# Altium project BOOSTXL-DRV8301.PrjPcb (part 2 of 2)

## Sheet SENSE.SchDoc
size 558 x 431 mm; Engineer: Nicholas Oborny; Revision: A.1; Name: Nicholas Oborny; Start Date: 7/23/2012
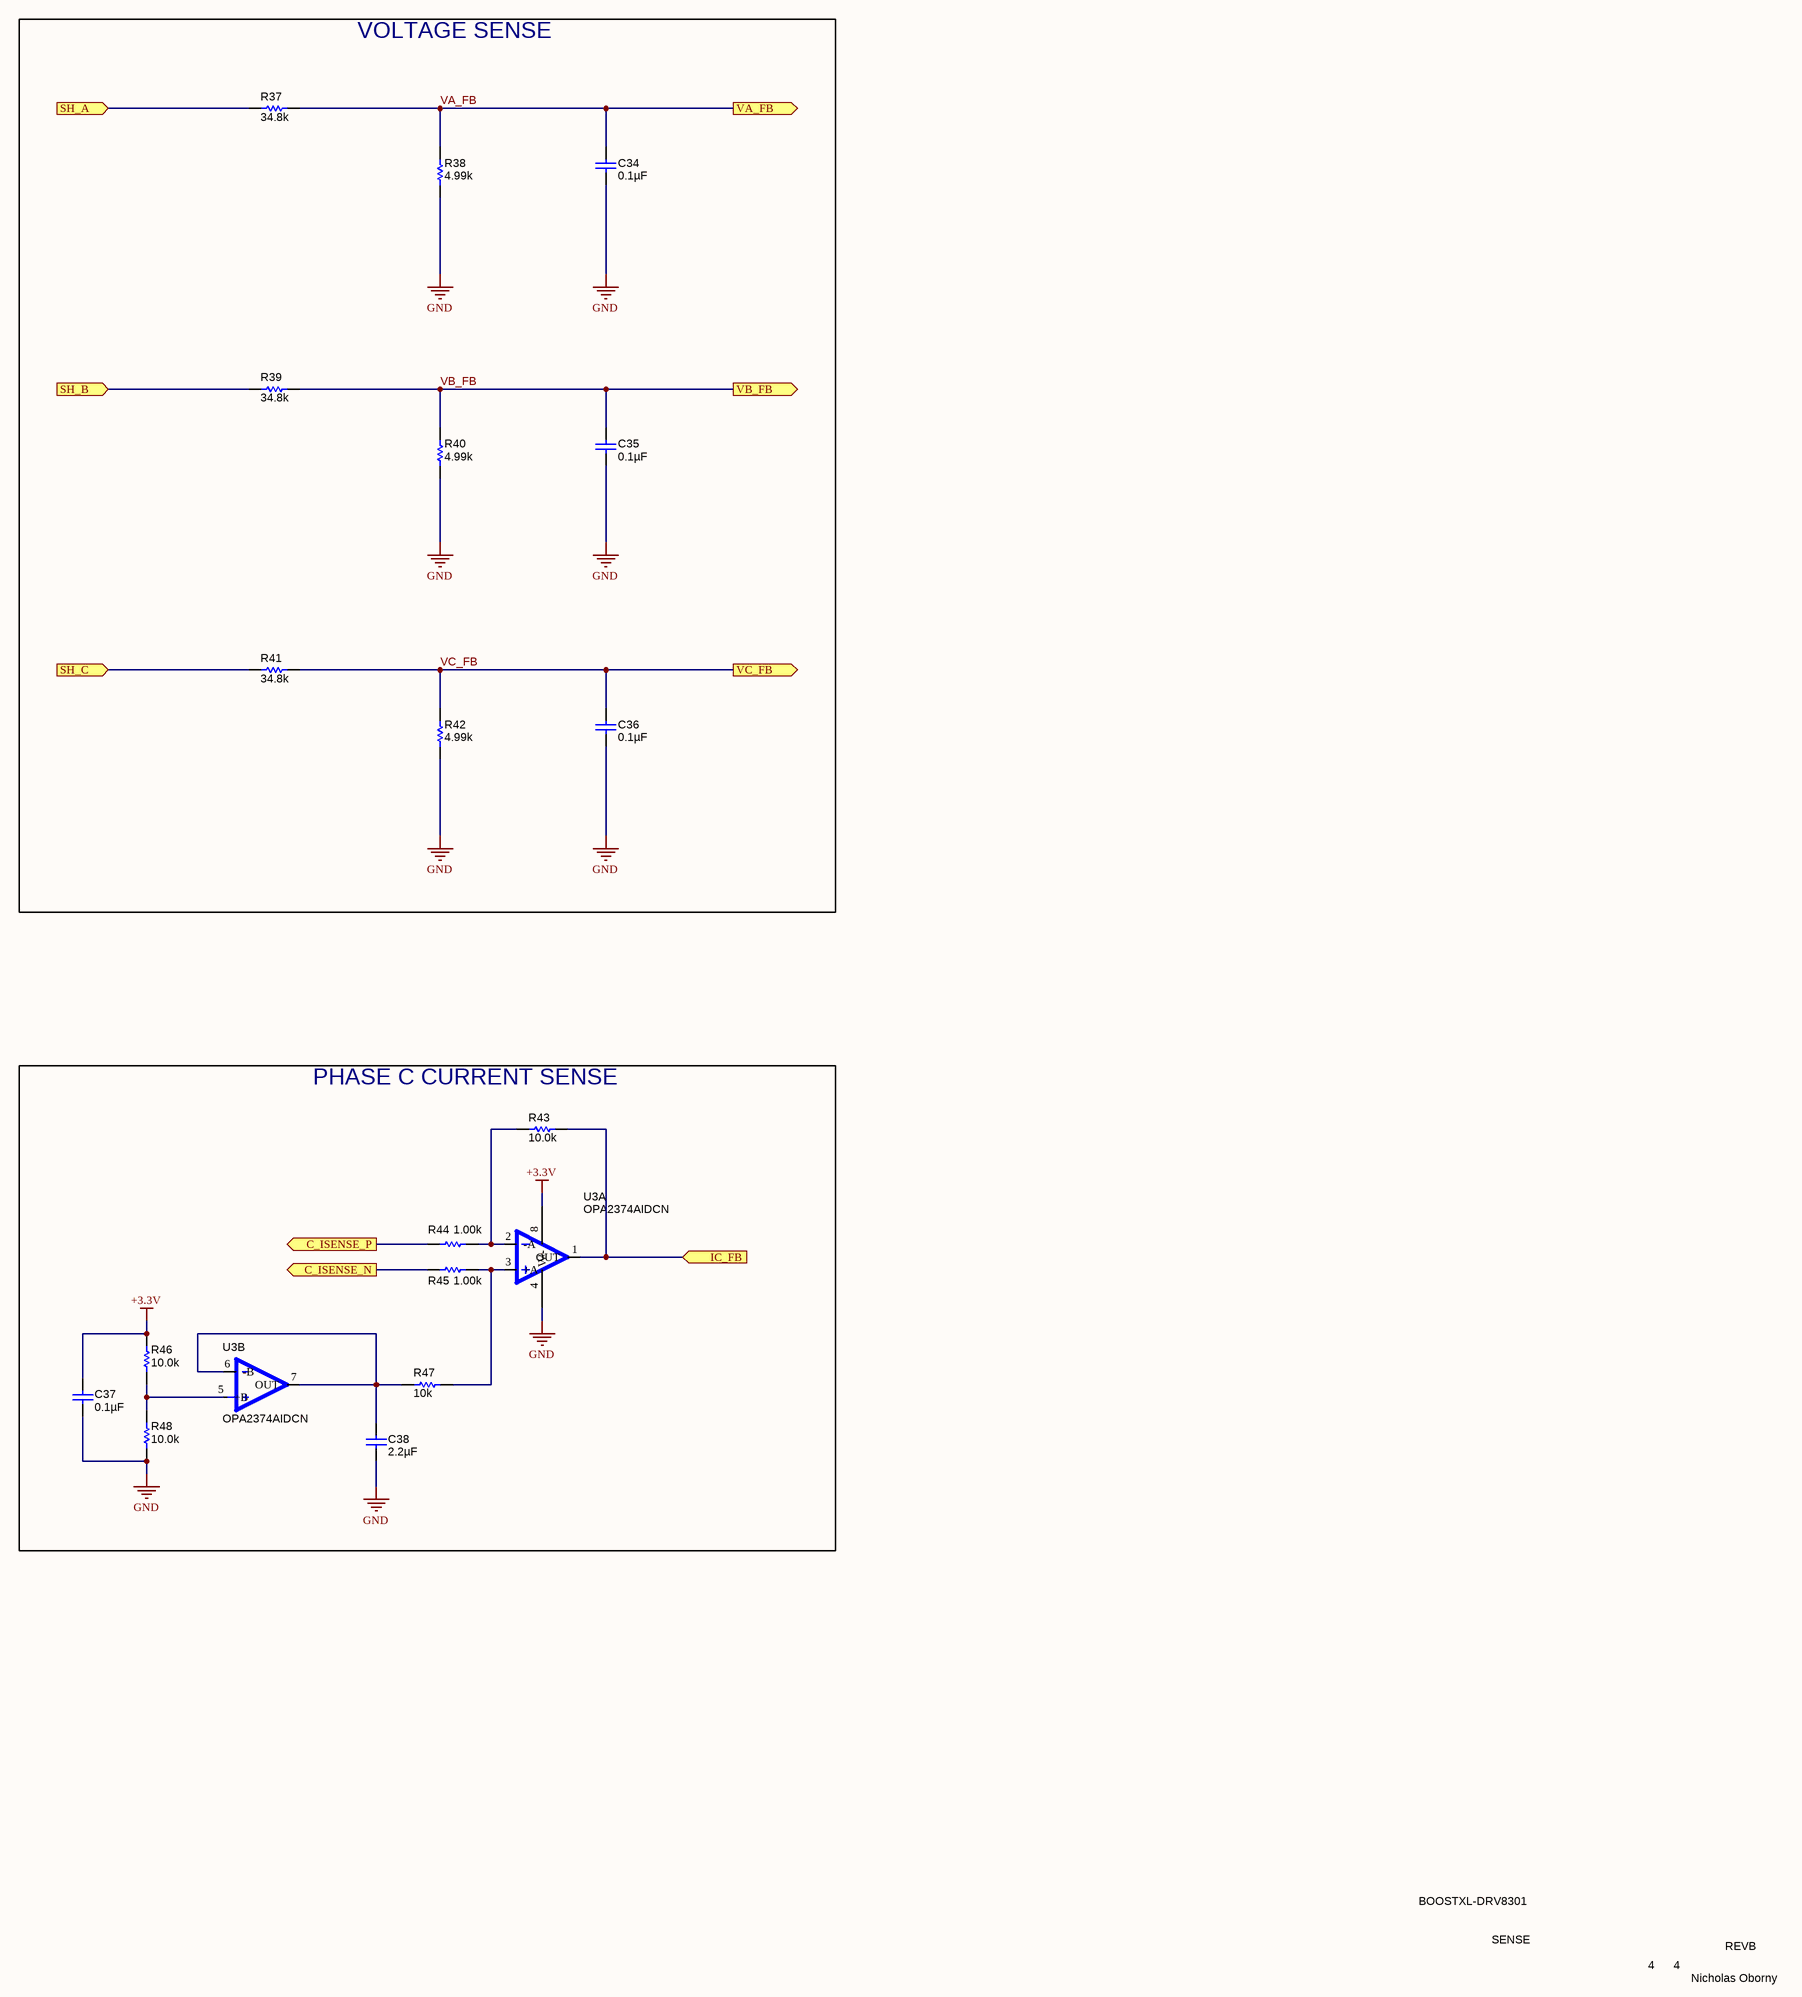
[diagram p7: SENSE.SchDoc]

### Parts
C34  ValueDisplayed: 0.1µF  [0603L]  (hidden comment: C0603C104J4RACTU)
C35  ValueDisplayed: 0.1µF  [0603L]  (hidden comment: C0603C104J4RACTU)
C36  ValueDisplayed: 0.1µF  [0603L]  (hidden comment: C0603C104J4RACTU)
C37  ValueDisplayed: 0.1µF  [0603L]  (hidden comment: C0603C104J4RACTU)
C38  ValueDisplayed: 2.2µF  [0603L]  (hidden comment: C0603C225M8PACTU)
R37  value 34.8k  [0603L]  (hidden comment: CRCW060334K8FKEA)
R38  value 4.99k  [0603L]  (hidden comment: CRCW06034K99FKEA)
R39  value 34.8k  [0603L]  (hidden comment: CRCW060334K8FKEA)
R40  value 4.99k  [0603L]  (hidden comment: CRCW06034K99FKEA)
R41  value 34.8k  [0603L]  (hidden comment: CRCW060334K8FKEA)
R42  value 4.99k  [0603L]  (hidden comment: CRCW06034K99FKEA)
R43  value 10.0k  [0603L]  (hidden comment: RG1608P-103-B-T5)
R44  value 1.00k  [0603L]  (hidden comment: CRCW06031K00FKEA)
R45  value 1.00k  [0603L]  (hidden comment: CRCW06031K00FKEA)
R46  value 10.0k  [0603L]  (hidden comment: RG1608P-103-B-T5)
R47  value 10k  [0603L]  (hidden comment: CRCW060310K0JNEA)
R48  value 10.0k  [0603L]  (hidden comment: RG1608P-103-B-T5)
U3  OPA2374AIDCN  [DCN]  (parts A,B of 2)

### Blocks framed on the sheet
VOLTAGE SENSE: C34-C36 R37-R42
PHASE C CURRENT SENSE: C37 C38 R43-R48 U3

### Ports
C_ISENSE_N, C_ISENSE_P, IC_FB, SH_A, SH_B, SH_C, VA_FB, VB_FB, VC_FB

### Nets
+3.3V: C37.1 R46.2 U3.8(V+)
GND: C34.2 C35.2 C36.2 C37.2 C38.2 R38.1 R40.1 R42.1 R48.1 U3.4(V-)
C_ISENSE_N: R45.1 ; port C_ISENSE_N
C_ISENSE_P: R44.1 ; port C_ISENSE_P
SH_A: R37.1 ; port SH_A
SH_B: R39.1 ; port SH_B
SH_C: R41.1 ; port SH_C
VA_FB: C34.1 R37.2 R38.2 ; port VA_FB
VB_FB: C35.1 R39.2 R40.2 ; port VB_FB
VC_FB: C36.1 R41.2 R42.2 ; port VC_FB
NetC38_1: C38.1 R47.1 U3.6(-B) U3.7(OUT)
NetR27_2: R43.2 U3.1(OUT) ; port IC_FB
NetR43_1: R43.1 R44.2 U3.2(-A)
NetR45_2: R45.2 R47.2 U3.3(+A)
NetR46_1: R46.1 R48.2 U3.5(+B)

### Notes on the sheet
- BOOSTXL-DRV8301
- SENSE
- 4
- REVB
- Nicholas Oborny

### Library data of the parts
C34-C37 = C0603C104J4RACTU: CAP, CERM, 0.1uF, 16V, +/-5%, X7R, 0603; Manufacturer: Kemet; Polarized: N; CompType: Capacitor; U/M: EA; Cap_F: 0.0000001; Tolerance_%: 5; Value1: Unknown; VDC_V: 16; TaMin_C: -55; TaMax_C: 125; Cap_Case: 0603; SymbolVersion: 2008-07-09; Value: 0.1uF; PartNumber: C0603C104J4RACTU; PackageReference: 0603; RoHS: Y; Value2: 16V; MountType: SMT; Technology: Ceramic; TempCo: X7R; Published: 2008-06-19; Publisher: Texas Instruments; LatestRevisionDate: 2013-05-24; LatestRevisionNote: Changed publisher; ComponentLink1Description: Datasheet link; ComponentLink1URL: http://www.kemet.com/kemet/web/homepage/kechome.nsf/vapubfiles/F3102_Y5V.pdf/$file/F3102_Y5V.pdf; Supplier 1: Digi-Key; Supplier Part Number 1: 399-1097-1-ND; Supplier 2: Mouser; Supplier Part Number 2: 80-C0603C104J4R; Supplier 3: Farnell; Supplier Part Number 3: 1650834
C38 = C0603C225M8PACTU: CAP, CERM, 2.2uF, 10V, +/-20%, X5R, 0603; Manufacturer: Kemet; Polarized: N; CompType: Capacitor; U/M: EA; Cap_F: 0.0000022; Tolerance_%: 20; Value1: Unknown; VDC_V: 10; TaMin_C: -55; TaMax_C: 85; Cap_Case: 0603; SymbolVersion: 2008-07-09; Value: 2.2uF; PartNumber: C0603C225M8PACTU; PackageReference: 0603; RoHS: Y; Value2: 10V; MountType: SMT; Technology: Ceramic; TempCo: X5R; Published: 2008-06-19; Publisher: Texas Instruments; LatestRevisionDate: 2013-05-24; LatestRevisionNote: Changed publisher; ComponentLink1Description: Datasheet link; ComponentLink1URL: http://www.kemet.com/kemet/web/homepage/kechome.nsf/vapubfiles/F3102_Y5V.pdf/$file/F3102_Y5V.pdf; Supplier 1: Digi-Key; Supplier Part Number 1: 399-4912-1-ND; Supplier 2: Mouser; Supplier Part Number 2: 80-C0603C225M8P
R37 R39 R41 = CRCW060334K8FKEA: RES, 34.8k ohm, 1%, 0.1W, 0603; Manufacturer: Vishay-Dale; CompType: Resistor; Res_ohm: 34800; Value_Code: 34k8; Tolerance_%: 1; Power_W: 0.1; VDC_V: 75; TempCo: 100 ppm/C; EIA_Code: E96; U/M: EA; SymbolVersion: 2009-05-29; PartNumber: CRCW060334K8FKEA; PackageReference: 0603; RoHS: Y; Value1: 1%; Value2: 0.1W; MountType: SMT; Technology: Thick Film; Published: 2008-06-26; Publisher: Texas Instruments; LatestRevisionDate: 2013-01-08; ComponentLink1Description: Datasheet link; ComponentLink1URL: http://www.vishay.com/docs/20035/dcrcwe3.pdf; Supplier 1: Digi-Key; Supplier Part Number 1: 541-34.8KHCT-ND; Supplier 2: Mouser; Supplier Part Number 2: 71-CRCW0603-34.8K-E3; Supplier 3: Farnell; Supplier Part Number 3: 1151951
R38 R40 R42 = CRCW06034K99FKEA: RES, 4.99k ohm, 1%, 0.1W, 0603; Manufacturer: Vishay-Dale; CompType: Resistor; Res_ohm: 4990; Value_Code: 4k99; Tolerance_%: 1; Power_W: 0.1; VDC_V: 75; TempCo: 100 ppm/C; EIA_Code: E96; U/M: EA; SymbolVersion: 2009-05-29; PartNumber: CRCW06034K99FKEA; PackageReference: 0603; RoHS: Y; Value1: 1%; Value2: 0.1W; MountType: SMT; Technology: Thick Film; Published: 2008-06-26; Publisher: Texas Instruments; LatestRevisionDate: 2013-01-08; ComponentLink1Description: Datasheet link; ComponentLink1URL: http://www.vishay.com/docs/20035/dcrcwe3.pdf; Supplier 1: Digi-Key; Supplier Part Number 1: 541-4.99KHCT-ND; Supplier 2: Mouser; Supplier Part Number 2: 71-CRCW0603-4.99K-E3; Supplier 3: Farnell; Supplier Part Number 3: 1652885
R43 R46 R48 = RG1608P-103-B-T5: RES, 10.0k ohm, 0.1%, 0.1W, 0603; Manufacturer: Susumu Co Ltd; CompType: Resistor; Res_ohm: 10000; Value_Code: 10k0; Tolerance_%: 0.1; VDC_V: 75; TempCo: 25 ppm/C; EIA_Code: E192; U/M: EA; SymbolVersion: 2009-05-29; PartNumber: RG1608P-103-B-T5; PackageReference: 0603; RoHS: Y; Value1: 0.1%; Power_W: 0.1; Value2: 0.1W; MountType: SMT; Technology: Metal Film; Published: 2008-06-26; Publisher: Texas Instruments; LatestRevisionDate: 2013-01-08; ComponentLink1Description: Datasheet link; ComponentLink1URL: http://www.susumu.co.jp/english/pdf/products-j01-01.pdf; Supplier 1: Digi-Key; Supplier Part Number 1: RG16P10.0KBCT-ND; Supplier 2: Mouser; Supplier Part Number 2: 754-RG1608P-103-B-T5; Supplier 3: Farnell; Supplier Part Number 3: 1797079
R44 R45 = CRCW06031K00FKEA: RES, 1.00k ohm, 1%, 0.1W, 0603; Manufacturer: Vishay-Dale; CompType: Resistor; Res_ohm: 1000; Value_Code: 1k00; Tolerance_%: 1; Power_W: 0.1; VDC_V: 75; TempCo: 100 ppm/C; EIA_Code: E96; U/M: EA; SymbolVersion: 2009-05-29; PartNumber: CRCW06031K00FKEA; PackageReference: 0603; RoHS: Y; Value1: 1%; Value2: 0.1W; MountType: SMT; Technology: Thick Film; Published: 2008-06-26; Publisher: Texas Instruments; LatestRevisionDate: 2013-01-08; ComponentLink1Description: Datasheet link; ComponentLink1URL: http://www.vishay.com/docs/20035/dcrcwe3.pdf; Supplier 1: Digi-Key; Supplier Part Number 1: 541-1.00KHCT-ND; Supplier 2: Mouser; Supplier Part Number 2: 71-CRCW0603-1.0K-E3; Supplier 3: Farnell; Supplier Part Number 3: 1469740
R47 = CRCW060310K0JNEA: RES, 10k ohm, 5%, 0.1W, 0603; Manufacturer: Vishay-Dale; CompType: Resistor; Res_ohm: 10000; Value_Code: 10k0; Tolerance_%: 5; Power_W: 0.1; VDC_V: 75; TempCo: 200 ppm/C; EIA_Code: E24; U/M: EA; SymbolVersion: 2009-05-29; PartNumber: CRCW060310K0JNEA; PackageReference: 0603; RoHS: Y; Value1: 5%; Value2: 0.1W; MountType: SMT; Technology: Thick Film; Published: 2008-06-26; Publisher: Texas Instruments; LatestRevisionDate: 2013-01-08; ComponentLink1Description: Datasheet link; ComponentLink1URL: http://www.vishay.com/docs/20035/dcrcwe3.pdf; Supplier 1: Digi-Key; Supplier Part Number 1: 541-10KGCT-ND; Supplier 2: Farnell; Supplier Part Number 2: 1562240; Supplier 3: Newark; Supplier Part Number 3: 52K8066
U3 = OPA2374AIDCN: IC, CMOS, R-R I/O  Op Amp, Single Supply, 6.5MHz, 585uA; Manufacturer: TI; Area: 27000; Value: OPA2374AIDCNx; ComponentLink1URL: \\vette02\pmp_pcb\pcad_pdf's\opa374.pdf; SymbolVersion: 05/07/2008 14:19:55; PackageReference: SSOP-8; ComponentHeight: 0.043 inch; PartNumber: OPA2374AIDCN; ComponentLink1Description: AEO Datasheet Link

## Nets that join several sheets
+3.3V: DRV8301 (13 pins), LAUNCHPAD (D5.2 J3.2 U2.5), SENSE (C37.1 R46.2 U3.8)
+PVDD: DRV8301 (7 pins), LAUNCHPAD (7 pins), MOTOR (6 pins)
GND: DRV8301 (27 pins), LAUNCHPAD (15 pins), MOTOR (9 pins), SENSE (10 pins)
~{FAULT}: DRV8301 (Q2.1 R3.1 U1.6), LAUNCHPAD (J3.6)
~{OCTW}: DRV8301 (Q1.1 R2.1 U1.5), LAUNCHPAD (J3.8)
A_ISENSE_N: DRV8301 (U1.32), MOTOR (C31.2 J8.2)
A_ISENSE_P: DRV8301 (U1.33), MOTOR (C31.1 J5.2)
B_ISENSE_N: DRV8301 (U1.30), MOTOR (C32.2 J9.2)
B_ISENSE_P: DRV8301 (U1.31), MOTOR (C32.1 J6.2)
C_ISENSE_N: MOTOR (C33.2 J10.2), SENSE (R45.1)
C_ISENSE_P: MOTOR (C33.1 J7.2), SENSE (R44.1)
DC_CAL: DRV8301 (R9.2 U1.12), LAUNCHPAD (J4.17)
EN_GATE: DRV8301 (R6.2 U1.16), LAUNCHPAD (J4.15)
GAIN/SDO: DRV8301 (R18.2 U1.10), LAUNCHPAD (J4.13)
GH_A: DRV8301 (U1.47), MOTOR (R28.1)
GH_B: DRV8301 (U1.42), MOTOR (R29.1)
GH_C: DRV8301 (U1.37), MOTOR (R30.1)
GL_A: DRV8301 (U1.45), MOTOR (R31.1)
GL_B: DRV8301 (U1.40), MOTOR (R32.1)
GL_C: DRV8301 (U1.35), MOTOR (R33.1)
IA_FB: DRV8301 (U1.25), LAUNCHPAD (R25.2)
IB_FB: DRV8301 (U1.26), LAUNCHPAD (R26.2)
M_OC/SDI: DRV8301 (R13.1 U1.9), LAUNCHPAD (J4.11)
M_PWM~{/}SCS: DRV8301 (R17.2 U1.8), LAUNCHPAD (J4.3)
NetJ3_14: DRV8301 (R16.1), LAUNCHPAD (J3.14)
NetR27_2: LAUNCHPAD (R27.2), SENSE (R43.2 U3.1)
PWM_AH: DRV8301 (U1.17), LAUNCHPAD (J4.2)
PWM_AL: DRV8301 (U1.18), LAUNCHPAD (J4.4)
PWM_BH: DRV8301 (U1.19), LAUNCHPAD (J4.6)
PWM_BL: DRV8301 (U1.20), LAUNCHPAD (J4.8)
PWM_CH: DRV8301 (U1.21), LAUNCHPAD (J4.10)
PWM_CL: DRV8301 (U1.22), LAUNCHPAD (J4.12)
SH_A: DRV8301 (C5.2 U1.46), MOTOR (5 pins), SENSE (R37.1)
SH_B: DRV8301 (C6.2 U1.41), MOTOR (5 pins), SENSE (R39.1)
SH_C: DRV8301 (C7.2 U1.36), MOTOR (5 pins), SENSE (R41.1)
SL_A: DRV8301 (U1.44), MOTOR (5 pins)
SL_B: DRV8301 (U1.39), MOTOR (5 pins)
SL_C: DRV8301 (U1.34), MOTOR (5 pins)
VA_FB: LAUNCHPAD (J3.7 U2.3), SENSE (C34.1 R37.2 R38.2)
VB_FB: LAUNCHPAD (J3.9 U2.4), SENSE (C35.1 R39.2 R40.2)
VC_FB: LAUNCHPAD (J3.11 U2.6), SENSE (C36.1 R41.2 R42.2)